# EasyEDA Pro project RinaBoard_V1_0.eprj, schematic LEDBoard
Board Name: LEDBoard; Create Date: 2024-11-24; Page Name: P1; Project Name: RinaBoard; Schematic Name: LEDBoard; Update Date: 2024-11-25; Company: 嘉立创EDA; Page Size: A4; Version: V1.0
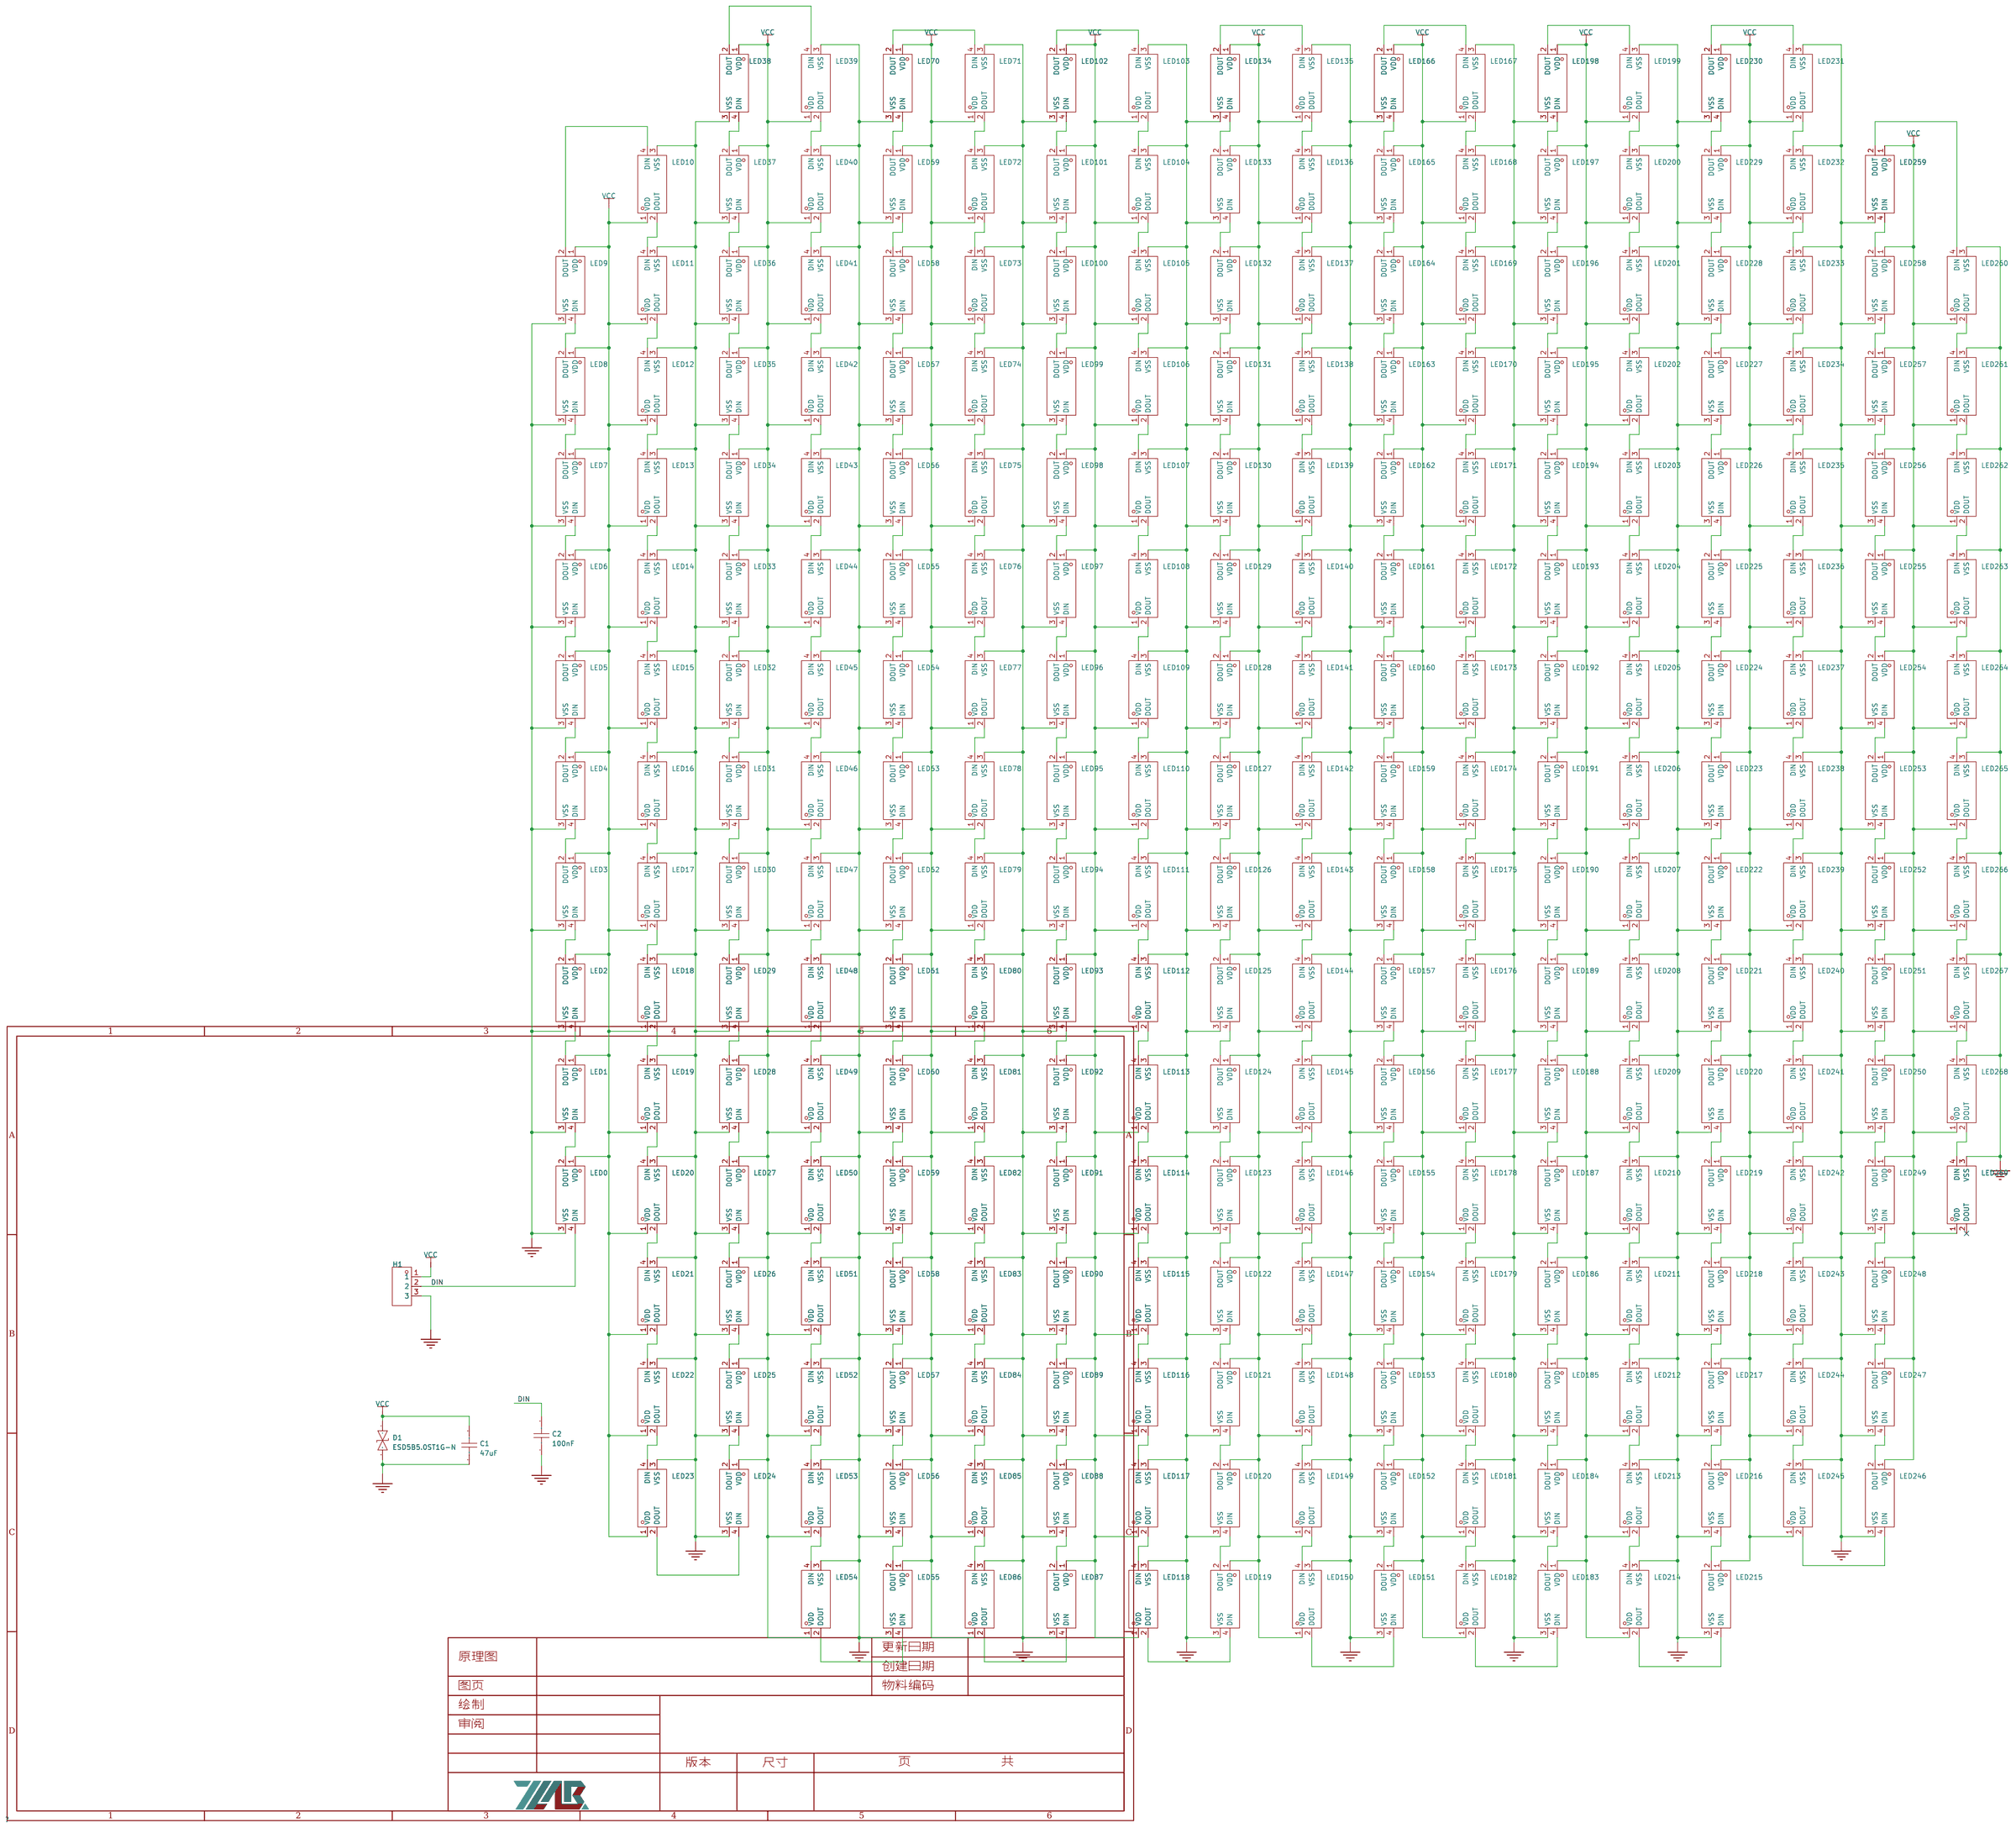
[diagram p0: schematic sheet]

## Parts
C1  47uF  [C1206]
C2  100nF  [C0603]
D1  ESD5B5.0ST1G-N  [SOD-523_L1.2-W0.8-LS1.6-BI]
H1  -  [HDR-TH_3P-P2.54-V-F]
LED0  WS2812B-MINI-V3/W  [LED-SMD_4P-L3.5-W3.5-TL_WS2812B]
LED1  WS2812B-MINI-V3/W  [LED-SMD_4P-L3.5-W3.5-TL_WS2812B]
LED2  WS2812B-MINI-V3/W  [LED-SMD_4P-L3.5-W3.5-TL_WS2812B]
LED3  WS2812B-MINI-V3/W  [LED-SMD_4P-L3.5-W3.5-TL_WS2812B]
LED4  WS2812B-MINI-V3/W  [LED-SMD_4P-L3.5-W3.5-TL_WS2812B]
LED5  WS2812B-MINI-V3/W  [LED-SMD_4P-L3.5-W3.5-TL_WS2812B]
LED6  WS2812B-MINI-V3/W  [LED-SMD_4P-L3.5-W3.5-TL_WS2812B]
LED7  WS2812B-MINI-V3/W  [LED-SMD_4P-L3.5-W3.5-TL_WS2812B]
LED8  WS2812B-MINI-V3/W  [LED-SMD_4P-L3.5-W3.5-TL_WS2812B]
LED9  WS2812B-MINI-V3/W  [LED-SMD_4P-L3.5-W3.5-TL_WS2812B]
LED10  WS2812B-MINI-V3/W  [LED-SMD_4P-L3.5-W3.5-TL_WS2812B]
LED11  WS2812B-MINI-V3/W  [LED-SMD_4P-L3.5-W3.5-TL_WS2812B]
LED12  WS2812B-MINI-V3/W  [LED-SMD_4P-L3.5-W3.5-TL_WS2812B]
LED13  WS2812B-MINI-V3/W  [LED-SMD_4P-L3.5-W3.5-TL_WS2812B]
LED14  WS2812B-MINI-V3/W  [LED-SMD_4P-L3.5-W3.5-TL_WS2812B]
LED15  WS2812B-MINI-V3/W  [LED-SMD_4P-L3.5-W3.5-TL_WS2812B]
LED16  WS2812B-MINI-V3/W  [LED-SMD_4P-L3.5-W3.5-TL_WS2812B]
LED17  WS2812B-MINI-V3/W  [LED-SMD_4P-L3.5-W3.5-TL_WS2812B]
LED18  WS2812B-MINI-V3/W  [LED-SMD_4P-L3.5-W3.5-TL_WS2812B]
LED19  WS2812B-MINI-V3/W  [LED-SMD_4P-L3.5-W3.5-TL_WS2812B]
LED20  WS2812B-MINI-V3/W  [LED-SMD_4P-L3.5-W3.5-TL_WS2812B]
LED21  WS2812B-MINI-V3/W  [LED-SMD_4P-L3.5-W3.5-TL_WS2812B]
LED22  WS2812B-MINI-V3/W  [LED-SMD_4P-L3.5-W3.5-TL_WS2812B]
LED23  WS2812B-MINI-V3/W  [LED-SMD_4P-L3.5-W3.5-TL_WS2812B]
LED24  WS2812B-MINI-V3/W  [LED-SMD_4P-L3.5-W3.5-TL_WS2812B]
LED25  WS2812B-MINI-V3/W  [LED-SMD_4P-L3.5-W3.5-TL_WS2812B]
LED26  WS2812B-MINI-V3/W  [LED-SMD_4P-L3.5-W3.5-TL_WS2812B]
LED27  WS2812B-MINI-V3/W  [LED-SMD_4P-L3.5-W3.5-TL_WS2812B]
LED28  WS2812B-MINI-V3/W  [LED-SMD_4P-L3.5-W3.5-TL_WS2812B]
LED29  WS2812B-MINI-V3/W  [LED-SMD_4P-L3.5-W3.5-TL_WS2812B]
LED30  WS2812B-MINI-V3/W  [LED-SMD_4P-L3.5-W3.5-TL_WS2812B]
LED31  WS2812B-MINI-V3/W  [LED-SMD_4P-L3.5-W3.5-TL_WS2812B]
LED32  WS2812B-MINI-V3/W  [LED-SMD_4P-L3.5-W3.5-TL_WS2812B]
LED33  WS2812B-MINI-V3/W  [LED-SMD_4P-L3.5-W3.5-TL_WS2812B]
LED34  WS2812B-MINI-V3/W  [LED-SMD_4P-L3.5-W3.5-TL_WS2812B]
LED35  WS2812B-MINI-V3/W  [LED-SMD_4P-L3.5-W3.5-TL_WS2812B]
LED36  WS2812B-MINI-V3/W  [LED-SMD_4P-L3.5-W3.5-TL_WS2812B]
LED37  WS2812B-MINI-V3/W  [LED-SMD_4P-L3.5-W3.5-TL_WS2812B]
LED38  WS2812B-MINI-V3/W  [LED-SMD_4P-L3.5-W3.5-TL_WS2812B]
LED39  WS2812B-MINI-V3/W  [LED-SMD_4P-L3.5-W3.5-TL_WS2812B]
LED40  WS2812B-MINI-V3/W  [LED-SMD_4P-L3.5-W3.5-TL_WS2812B]
LED41  WS2812B-MINI-V3/W  [LED-SMD_4P-L3.5-W3.5-TL_WS2812B]
LED42  WS2812B-MINI-V3/W  [LED-SMD_4P-L3.5-W3.5-TL_WS2812B]
LED43  WS2812B-MINI-V3/W  [LED-SMD_4P-L3.5-W3.5-TL_WS2812B]
LED44  WS2812B-MINI-V3/W  [LED-SMD_4P-L3.5-W3.5-TL_WS2812B]
LED45  WS2812B-MINI-V3/W  [LED-SMD_4P-L3.5-W3.5-TL_WS2812B]
LED46  WS2812B-MINI-V3/W  [LED-SMD_4P-L3.5-W3.5-TL_WS2812B]
LED47  WS2812B-MINI-V3/W  [LED-SMD_4P-L3.5-W3.5-TL_WS2812B]
LED48  WS2812B-MINI-V3/W  [LED-SMD_4P-L3.5-W3.5-TL_WS2812B]
LED49  WS2812B-MINI-V3/W  [LED-SMD_4P-L3.5-W3.5-TL_WS2812B]
LED50  WS2812B-MINI-V3/W  [LED-SMD_4P-L3.5-W3.5-TL_WS2812B]
LED51  WS2812B-MINI-V3/W  [LED-SMD_4P-L3.5-W3.5-TL_WS2812B]
LED52  WS2812B-MINI-V3/W  [LED-SMD_4P-L3.5-W3.5-TL_WS2812B]
LED53  WS2812B-MINI-V3/W  [LED-SMD_4P-L3.5-W3.5-TL_WS2812B]
LED54  WS2812B-MINI-V3/W  [LED-SMD_4P-L3.5-W3.5-TL_WS2812B]
LED55  WS2812B-MINI-V3/W  [LED-SMD_4P-L3.5-W3.5-TL_WS2812B]
LED56  WS2812B-MINI-V3/W  [LED-SMD_4P-L3.5-W3.5-TL_WS2812B]
LED57  WS2812B-MINI-V3/W  [LED-SMD_4P-L3.5-W3.5-TL_WS2812B]
LED58  WS2812B-MINI-V3/W  [LED-SMD_4P-L3.5-W3.5-TL_WS2812B]
LED59  WS2812B-MINI-V3/W  [LED-SMD_4P-L3.5-W3.5-TL_WS2812B]
LED60  WS2812B-MINI-V3/W  [LED-SMD_4P-L3.5-W3.5-TL_WS2812B]
LED61  WS2812B-MINI-V3/W  [LED-SMD_4P-L3.5-W3.5-TL_WS2812B]
LED62  WS2812B-MINI-V3/W  [LED-SMD_4P-L3.5-W3.5-TL_WS2812B]
LED63  WS2812B-MINI-V3/W  [LED-SMD_4P-L3.5-W3.5-TL_WS2812B]
LED64  WS2812B-MINI-V3/W  [LED-SMD_4P-L3.5-W3.5-TL_WS2812B]
LED65  WS2812B-MINI-V3/W  [LED-SMD_4P-L3.5-W3.5-TL_WS2812B]
LED66  WS2812B-MINI-V3/W  [LED-SMD_4P-L3.5-W3.5-TL_WS2812B]
LED67  WS2812B-MINI-V3/W  [LED-SMD_4P-L3.5-W3.5-TL_WS2812B]
LED68  WS2812B-MINI-V3/W  [LED-SMD_4P-L3.5-W3.5-TL_WS2812B]
LED69  WS2812B-MINI-V3/W  [LED-SMD_4P-L3.5-W3.5-TL_WS2812B]
LED70  WS2812B-MINI-V3/W  [LED-SMD_4P-L3.5-W3.5-TL_WS2812B]
LED71  WS2812B-MINI-V3/W  [LED-SMD_4P-L3.5-W3.5-TL_WS2812B]
LED72  WS2812B-MINI-V3/W  [LED-SMD_4P-L3.5-W3.5-TL_WS2812B]
LED73  WS2812B-MINI-V3/W  [LED-SMD_4P-L3.5-W3.5-TL_WS2812B]
LED74  WS2812B-MINI-V3/W  [LED-SMD_4P-L3.5-W3.5-TL_WS2812B]
LED75  WS2812B-MINI-V3/W  [LED-SMD_4P-L3.5-W3.5-TL_WS2812B]
LED76  WS2812B-MINI-V3/W  [LED-SMD_4P-L3.5-W3.5-TL_WS2812B]
LED77  WS2812B-MINI-V3/W  [LED-SMD_4P-L3.5-W3.5-TL_WS2812B]
LED78  WS2812B-MINI-V3/W  [LED-SMD_4P-L3.5-W3.5-TL_WS2812B]
LED79  WS2812B-MINI-V3/W  [LED-SMD_4P-L3.5-W3.5-TL_WS2812B]
LED80  WS2812B-MINI-V3/W  [LED-SMD_4P-L3.5-W3.5-TL_WS2812B]
LED81  WS2812B-MINI-V3/W  [LED-SMD_4P-L3.5-W3.5-TL_WS2812B]
LED82  WS2812B-MINI-V3/W  [LED-SMD_4P-L3.5-W3.5-TL_WS2812B]
LED83  WS2812B-MINI-V3/W  [LED-SMD_4P-L3.5-W3.5-TL_WS2812B]
LED84  WS2812B-MINI-V3/W  [LED-SMD_4P-L3.5-W3.5-TL_WS2812B]
LED85  WS2812B-MINI-V3/W  [LED-SMD_4P-L3.5-W3.5-TL_WS2812B]
LED86  WS2812B-MINI-V3/W  [LED-SMD_4P-L3.5-W3.5-TL_WS2812B]
LED87  WS2812B-MINI-V3/W  [LED-SMD_4P-L3.5-W3.5-TL_WS2812B]
LED88  WS2812B-MINI-V3/W  [LED-SMD_4P-L3.5-W3.5-TL_WS2812B]
LED89  WS2812B-MINI-V3/W  [LED-SMD_4P-L3.5-W3.5-TL_WS2812B]
LED90  WS2812B-MINI-V3/W  [LED-SMD_4P-L3.5-W3.5-TL_WS2812B]
LED91  WS2812B-MINI-V3/W  [LED-SMD_4P-L3.5-W3.5-TL_WS2812B]
LED92  WS2812B-MINI-V3/W  [LED-SMD_4P-L3.5-W3.5-TL_WS2812B]
LED93  WS2812B-MINI-V3/W  [LED-SMD_4P-L3.5-W3.5-TL_WS2812B]
LED94  WS2812B-MINI-V3/W  [LED-SMD_4P-L3.5-W3.5-TL_WS2812B]
LED95  WS2812B-MINI-V3/W  [LED-SMD_4P-L3.5-W3.5-TL_WS2812B]
LED96  WS2812B-MINI-V3/W  [LED-SMD_4P-L3.5-W3.5-TL_WS2812B]
LED97  WS2812B-MINI-V3/W  [LED-SMD_4P-L3.5-W3.5-TL_WS2812B]
LED98  WS2812B-MINI-V3/W  [LED-SMD_4P-L3.5-W3.5-TL_WS2812B]
LED99  WS2812B-MINI-V3/W  [LED-SMD_4P-L3.5-W3.5-TL_WS2812B]
LED100  WS2812B-MINI-V3/W  [LED-SMD_4P-L3.5-W3.5-TL_WS2812B]
LED101  WS2812B-MINI-V3/W  [LED-SMD_4P-L3.5-W3.5-TL_WS2812B]
LED102  WS2812B-MINI-V3/W  [LED-SMD_4P-L3.5-W3.5-TL_WS2812B]
LED103  WS2812B-MINI-V3/W  [LED-SMD_4P-L3.5-W3.5-TL_WS2812B]
LED104  WS2812B-MINI-V3/W  [LED-SMD_4P-L3.5-W3.5-TL_WS2812B]
LED105  WS2812B-MINI-V3/W  [LED-SMD_4P-L3.5-W3.5-TL_WS2812B]
LED106  WS2812B-MINI-V3/W  [LED-SMD_4P-L3.5-W3.5-TL_WS2812B]
LED107  WS2812B-MINI-V3/W  [LED-SMD_4P-L3.5-W3.5-TL_WS2812B]
LED108  WS2812B-MINI-V3/W  [LED-SMD_4P-L3.5-W3.5-TL_WS2812B]
LED109  WS2812B-MINI-V3/W  [LED-SMD_4P-L3.5-W3.5-TL_WS2812B]
LED110  WS2812B-MINI-V3/W  [LED-SMD_4P-L3.5-W3.5-TL_WS2812B]
LED111  WS2812B-MINI-V3/W  [LED-SMD_4P-L3.5-W3.5-TL_WS2812B]
LED112  WS2812B-MINI-V3/W  [LED-SMD_4P-L3.5-W3.5-TL_WS2812B]
LED113  WS2812B-MINI-V3/W  [LED-SMD_4P-L3.5-W3.5-TL_WS2812B]
LED114  WS2812B-MINI-V3/W  [LED-SMD_4P-L3.5-W3.5-TL_WS2812B]
LED115  WS2812B-MINI-V3/W  [LED-SMD_4P-L3.5-W3.5-TL_WS2812B]
LED116  WS2812B-MINI-V3/W  [LED-SMD_4P-L3.5-W3.5-TL_WS2812B]
LED117  WS2812B-MINI-V3/W  [LED-SMD_4P-L3.5-W3.5-TL_WS2812B]
LED118  WS2812B-MINI-V3/W  [LED-SMD_4P-L3.5-W3.5-TL_WS2812B]
LED119  WS2812B-MINI-V3/W  [LED-SMD_4P-L3.5-W3.5-TL_WS2812B]
LED120  WS2812B-MINI-V3/W  [LED-SMD_4P-L3.5-W3.5-TL_WS2812B]
LED121  WS2812B-MINI-V3/W  [LED-SMD_4P-L3.5-W3.5-TL_WS2812B]
LED122  WS2812B-MINI-V3/W  [LED-SMD_4P-L3.5-W3.5-TL_WS2812B]
LED123  WS2812B-MINI-V3/W  [LED-SMD_4P-L3.5-W3.5-TL_WS2812B]
LED124  WS2812B-MINI-V3/W  [LED-SMD_4P-L3.5-W3.5-TL_WS2812B]
LED125  WS2812B-MINI-V3/W  [LED-SMD_4P-L3.5-W3.5-TL_WS2812B]
LED126  WS2812B-MINI-V3/W  [LED-SMD_4P-L3.5-W3.5-TL_WS2812B]
LED127  WS2812B-MINI-V3/W  [LED-SMD_4P-L3.5-W3.5-TL_WS2812B]
LED128  WS2812B-MINI-V3/W  [LED-SMD_4P-L3.5-W3.5-TL_WS2812B]
LED129  WS2812B-MINI-V3/W  [LED-SMD_4P-L3.5-W3.5-TL_WS2812B]
LED130  WS2812B-MINI-V3/W  [LED-SMD_4P-L3.5-W3.5-TL_WS2812B]
LED131  WS2812B-MINI-V3/W  [LED-SMD_4P-L3.5-W3.5-TL_WS2812B]
LED132  WS2812B-MINI-V3/W  [LED-SMD_4P-L3.5-W3.5-TL_WS2812B]
LED133  WS2812B-MINI-V3/W  [LED-SMD_4P-L3.5-W3.5-TL_WS2812B]
LED134  WS2812B-MINI-V3/W  [LED-SMD_4P-L3.5-W3.5-TL_WS2812B]
LED135  WS2812B-MINI-V3/W  [LED-SMD_4P-L3.5-W3.5-TL_WS2812B]
LED136  WS2812B-MINI-V3/W  [LED-SMD_4P-L3.5-W3.5-TL_WS2812B]
LED137  WS2812B-MINI-V3/W  [LED-SMD_4P-L3.5-W3.5-TL_WS2812B]
LED138  WS2812B-MINI-V3/W  [LED-SMD_4P-L3.5-W3.5-TL_WS2812B]
LED139  WS2812B-MINI-V3/W  [LED-SMD_4P-L3.5-W3.5-TL_WS2812B]
LED140  WS2812B-MINI-V3/W  [LED-SMD_4P-L3.5-W3.5-TL_WS2812B]
LED141  WS2812B-MINI-V3/W  [LED-SMD_4P-L3.5-W3.5-TL_WS2812B]
LED142  WS2812B-MINI-V3/W  [LED-SMD_4P-L3.5-W3.5-TL_WS2812B]
LED143  WS2812B-MINI-V3/W  [LED-SMD_4P-L3.5-W3.5-TL_WS2812B]
LED144  WS2812B-MINI-V3/W  [LED-SMD_4P-L3.5-W3.5-TL_WS2812B]
LED145  WS2812B-MINI-V3/W  [LED-SMD_4P-L3.5-W3.5-TL_WS2812B]
LED146  WS2812B-MINI-V3/W  [LED-SMD_4P-L3.5-W3.5-TL_WS2812B]
LED147  WS2812B-MINI-V3/W  [LED-SMD_4P-L3.5-W3.5-TL_WS2812B]
LED148  WS2812B-MINI-V3/W  [LED-SMD_4P-L3.5-W3.5-TL_WS2812B]
LED149  WS2812B-MINI-V3/W  [LED-SMD_4P-L3.5-W3.5-TL_WS2812B]
LED150  WS2812B-MINI-V3/W  [LED-SMD_4P-L3.5-W3.5-TL_WS2812B]
LED151  WS2812B-MINI-V3/W  [LED-SMD_4P-L3.5-W3.5-TL_WS2812B]
LED152  WS2812B-MINI-V3/W  [LED-SMD_4P-L3.5-W3.5-TL_WS2812B]
LED153  WS2812B-MINI-V3/W  [LED-SMD_4P-L3.5-W3.5-TL_WS2812B]
LED154  WS2812B-MINI-V3/W  [LED-SMD_4P-L3.5-W3.5-TL_WS2812B]
LED155  WS2812B-MINI-V3/W  [LED-SMD_4P-L3.5-W3.5-TL_WS2812B]
LED156  WS2812B-MINI-V3/W  [LED-SMD_4P-L3.5-W3.5-TL_WS2812B]
LED157  WS2812B-MINI-V3/W  [LED-SMD_4P-L3.5-W3.5-TL_WS2812B]
LED158  WS2812B-MINI-V3/W  [LED-SMD_4P-L3.5-W3.5-TL_WS2812B]
LED159  WS2812B-MINI-V3/W  [LED-SMD_4P-L3.5-W3.5-TL_WS2812B]
LED160  WS2812B-MINI-V3/W  [LED-SMD_4P-L3.5-W3.5-TL_WS2812B]
LED161  WS2812B-MINI-V3/W  [LED-SMD_4P-L3.5-W3.5-TL_WS2812B]
LED162  WS2812B-MINI-V3/W  [LED-SMD_4P-L3.5-W3.5-TL_WS2812B]
LED163  WS2812B-MINI-V3/W  [LED-SMD_4P-L3.5-W3.5-TL_WS2812B]
LED164  WS2812B-MINI-V3/W  [LED-SMD_4P-L3.5-W3.5-TL_WS2812B]
LED165  WS2812B-MINI-V3/W  [LED-SMD_4P-L3.5-W3.5-TL_WS2812B]
LED166  WS2812B-MINI-V3/W  [LED-SMD_4P-L3.5-W3.5-TL_WS2812B]
LED167  WS2812B-MINI-V3/W  [LED-SMD_4P-L3.5-W3.5-TL_WS2812B]
LED168  WS2812B-MINI-V3/W  [LED-SMD_4P-L3.5-W3.5-TL_WS2812B]
LED169  WS2812B-MINI-V3/W  [LED-SMD_4P-L3.5-W3.5-TL_WS2812B]
LED170  WS2812B-MINI-V3/W  [LED-SMD_4P-L3.5-W3.5-TL_WS2812B]
LED171  WS2812B-MINI-V3/W  [LED-SMD_4P-L3.5-W3.5-TL_WS2812B]
LED172  WS2812B-MINI-V3/W  [LED-SMD_4P-L3.5-W3.5-TL_WS2812B]
LED173  WS2812B-MINI-V3/W  [LED-SMD_4P-L3.5-W3.5-TL_WS2812B]
LED174  WS2812B-MINI-V3/W  [LED-SMD_4P-L3.5-W3.5-TL_WS2812B]
LED175  WS2812B-MINI-V3/W  [LED-SMD_4P-L3.5-W3.5-TL_WS2812B]
LED176  WS2812B-MINI-V3/W  [LED-SMD_4P-L3.5-W3.5-TL_WS2812B]
LED177  WS2812B-MINI-V3/W  [LED-SMD_4P-L3.5-W3.5-TL_WS2812B]
LED178  WS2812B-MINI-V3/W  [LED-SMD_4P-L3.5-W3.5-TL_WS2812B]
LED179  WS2812B-MINI-V3/W  [LED-SMD_4P-L3.5-W3.5-TL_WS2812B]
LED180  WS2812B-MINI-V3/W  [LED-SMD_4P-L3.5-W3.5-TL_WS2812B]
LED181  WS2812B-MINI-V3/W  [LED-SMD_4P-L3.5-W3.5-TL_WS2812B]
LED182  WS2812B-MINI-V3/W  [LED-SMD_4P-L3.5-W3.5-TL_WS2812B]
LED183  WS2812B-MINI-V3/W  [LED-SMD_4P-L3.5-W3.5-TL_WS2812B]
LED184  WS2812B-MINI-V3/W  [LED-SMD_4P-L3.5-W3.5-TL_WS2812B]
LED185  WS2812B-MINI-V3/W  [LED-SMD_4P-L3.5-W3.5-TL_WS2812B]
LED186  WS2812B-MINI-V3/W  [LED-SMD_4P-L3.5-W3.5-TL_WS2812B]
LED187  WS2812B-MINI-V3/W  [LED-SMD_4P-L3.5-W3.5-TL_WS2812B]
LED188  WS2812B-MINI-V3/W  [LED-SMD_4P-L3.5-W3.5-TL_WS2812B]
LED189  WS2812B-MINI-V3/W  [LED-SMD_4P-L3.5-W3.5-TL_WS2812B]
LED190  WS2812B-MINI-V3/W  [LED-SMD_4P-L3.5-W3.5-TL_WS2812B]
LED191  WS2812B-MINI-V3/W  [LED-SMD_4P-L3.5-W3.5-TL_WS2812B]
LED192  WS2812B-MINI-V3/W  [LED-SMD_4P-L3.5-W3.5-TL_WS2812B]
LED193  WS2812B-MINI-V3/W  [LED-SMD_4P-L3.5-W3.5-TL_WS2812B]
LED194  WS2812B-MINI-V3/W  [LED-SMD_4P-L3.5-W3.5-TL_WS2812B]
LED195  WS2812B-MINI-V3/W  [LED-SMD_4P-L3.5-W3.5-TL_WS2812B]
LED196  WS2812B-MINI-V3/W  [LED-SMD_4P-L3.5-W3.5-TL_WS2812B]
LED197  WS2812B-MINI-V3/W  [LED-SMD_4P-L3.5-W3.5-TL_WS2812B]
LED198  WS2812B-MINI-V3/W  [LED-SMD_4P-L3.5-W3.5-TL_WS2812B]
LED199  WS2812B-MINI-V3/W  [LED-SMD_4P-L3.5-W3.5-TL_WS2812B]
LED200  WS2812B-MINI-V3/W  [LED-SMD_4P-L3.5-W3.5-TL_WS2812B]
LED201  WS2812B-MINI-V3/W  [LED-SMD_4P-L3.5-W3.5-TL_WS2812B]
LED202  WS2812B-MINI-V3/W  [LED-SMD_4P-L3.5-W3.5-TL_WS2812B]
LED203  WS2812B-MINI-V3/W  [LED-SMD_4P-L3.5-W3.5-TL_WS2812B]
LED204  WS2812B-MINI-V3/W  [LED-SMD_4P-L3.5-W3.5-TL_WS2812B]
LED205  WS2812B-MINI-V3/W  [LED-SMD_4P-L3.5-W3.5-TL_WS2812B]
LED206  WS2812B-MINI-V3/W  [LED-SMD_4P-L3.5-W3.5-TL_WS2812B]
LED207  WS2812B-MINI-V3/W  [LED-SMD_4P-L3.5-W3.5-TL_WS2812B]
LED208  WS2812B-MINI-V3/W  [LED-SMD_4P-L3.5-W3.5-TL_WS2812B]
LED209  WS2812B-MINI-V3/W  [LED-SMD_4P-L3.5-W3.5-TL_WS2812B]
LED210  WS2812B-MINI-V3/W  [LED-SMD_4P-L3.5-W3.5-TL_WS2812B]
LED211  WS2812B-MINI-V3/W  [LED-SMD_4P-L3.5-W3.5-TL_WS2812B]
LED212  WS2812B-MINI-V3/W  [LED-SMD_4P-L3.5-W3.5-TL_WS2812B]
LED213  WS2812B-MINI-V3/W  [LED-SMD_4P-L3.5-W3.5-TL_WS2812B]
LED214  WS2812B-MINI-V3/W  [LED-SMD_4P-L3.5-W3.5-TL_WS2812B]
LED215  WS2812B-MINI-V3/W  [LED-SMD_4P-L3.5-W3.5-TL_WS2812B]
LED216  WS2812B-MINI-V3/W  [LED-SMD_4P-L3.5-W3.5-TL_WS2812B]
LED217  WS2812B-MINI-V3/W  [LED-SMD_4P-L3.5-W3.5-TL_WS2812B]
LED218  WS2812B-MINI-V3/W  [LED-SMD_4P-L3.5-W3.5-TL_WS2812B]
LED219  WS2812B-MINI-V3/W  [LED-SMD_4P-L3.5-W3.5-TL_WS2812B]
LED220  WS2812B-MINI-V3/W  [LED-SMD_4P-L3.5-W3.5-TL_WS2812B]
LED221  WS2812B-MINI-V3/W  [LED-SMD_4P-L3.5-W3.5-TL_WS2812B]
LED222  WS2812B-MINI-V3/W  [LED-SMD_4P-L3.5-W3.5-TL_WS2812B]
LED223  WS2812B-MINI-V3/W  [LED-SMD_4P-L3.5-W3.5-TL_WS2812B]
LED224  WS2812B-MINI-V3/W  [LED-SMD_4P-L3.5-W3.5-TL_WS2812B]
LED225  WS2812B-MINI-V3/W  [LED-SMD_4P-L3.5-W3.5-TL_WS2812B]
LED226  WS2812B-MINI-V3/W  [LED-SMD_4P-L3.5-W3.5-TL_WS2812B]
LED227  WS2812B-MINI-V3/W  [LED-SMD_4P-L3.5-W3.5-TL_WS2812B]
LED228  WS2812B-MINI-V3/W  [LED-SMD_4P-L3.5-W3.5-TL_WS2812B]
LED229  WS2812B-MINI-V3/W  [LED-SMD_4P-L3.5-W3.5-TL_WS2812B]
LED230  WS2812B-MINI-V3/W  [LED-SMD_4P-L3.5-W3.5-TL_WS2812B]
LED231  WS2812B-MINI-V3/W  [LED-SMD_4P-L3.5-W3.5-TL_WS2812B]
LED232  WS2812B-MINI-V3/W  [LED-SMD_4P-L3.5-W3.5-TL_WS2812B]
LED233  WS2812B-MINI-V3/W  [LED-SMD_4P-L3.5-W3.5-TL_WS2812B]
LED234  WS2812B-MINI-V3/W  [LED-SMD_4P-L3.5-W3.5-TL_WS2812B]
LED235  WS2812B-MINI-V3/W  [LED-SMD_4P-L3.5-W3.5-TL_WS2812B]
LED236  WS2812B-MINI-V3/W  [LED-SMD_4P-L3.5-W3.5-TL_WS2812B]
LED237  WS2812B-MINI-V3/W  [LED-SMD_4P-L3.5-W3.5-TL_WS2812B]
LED238  WS2812B-MINI-V3/W  [LED-SMD_4P-L3.5-W3.5-TL_WS2812B]
LED239  WS2812B-MINI-V3/W  [LED-SMD_4P-L3.5-W3.5-TL_WS2812B]
LED240  WS2812B-MINI-V3/W  [LED-SMD_4P-L3.5-W3.5-TL_WS2812B]
LED241  WS2812B-MINI-V3/W  [LED-SMD_4P-L3.5-W3.5-TL_WS2812B]
LED242  WS2812B-MINI-V3/W  [LED-SMD_4P-L3.5-W3.5-TL_WS2812B]
LED243  WS2812B-MINI-V3/W  [LED-SMD_4P-L3.5-W3.5-TL_WS2812B]
LED244  WS2812B-MINI-V3/W  [LED-SMD_4P-L3.5-W3.5-TL_WS2812B]
LED245  WS2812B-MINI-V3/W  [LED-SMD_4P-L3.5-W3.5-TL_WS2812B]
LED246  WS2812B-MINI-V3/W  [LED-SMD_4P-L3.5-W3.5-TL_WS2812B]
LED247  WS2812B-MINI-V3/W  [LED-SMD_4P-L3.5-W3.5-TL_WS2812B]
LED248  WS2812B-MINI-V3/W  [LED-SMD_4P-L3.5-W3.5-TL_WS2812B]
LED249  WS2812B-MINI-V3/W  [LED-SMD_4P-L3.5-W3.5-TL_WS2812B]
LED250  WS2812B-MINI-V3/W  [LED-SMD_4P-L3.5-W3.5-TL_WS2812B]
LED251  WS2812B-MINI-V3/W  [LED-SMD_4P-L3.5-W3.5-TL_WS2812B]
LED252  WS2812B-MINI-V3/W  [LED-SMD_4P-L3.5-W3.5-TL_WS2812B]
LED253  WS2812B-MINI-V3/W  [LED-SMD_4P-L3.5-W3.5-TL_WS2812B]
LED254  WS2812B-MINI-V3/W  [LED-SMD_4P-L3.5-W3.5-TL_WS2812B]
LED255  WS2812B-MINI-V3/W  [LED-SMD_4P-L3.5-W3.5-TL_WS2812B]
LED256  WS2812B-MINI-V3/W  [LED-SMD_4P-L3.5-W3.5-TL_WS2812B]
LED257  WS2812B-MINI-V3/W  [LED-SMD_4P-L3.5-W3.5-TL_WS2812B]
LED258  WS2812B-MINI-V3/W  [LED-SMD_4P-L3.5-W3.5-TL_WS2812B]
LED259  WS2812B-MINI-V3/W  [LED-SMD_4P-L3.5-W3.5-TL_WS2812B]
LED260  WS2812B-MINI-V3/W  [LED-SMD_4P-L3.5-W3.5-TL_WS2812B]
LED261  WS2812B-MINI-V3/W  [LED-SMD_4P-L3.5-W3.5-TL_WS2812B]
LED262  WS2812B-MINI-V3/W  [LED-SMD_4P-L3.5-W3.5-TL_WS2812B]
LED263  WS2812B-MINI-V3/W  [LED-SMD_4P-L3.5-W3.5-TL_WS2812B]
LED264  WS2812B-MINI-V3/W  [LED-SMD_4P-L3.5-W3.5-TL_WS2812B]
LED265  WS2812B-MINI-V3/W  [LED-SMD_4P-L3.5-W3.5-TL_WS2812B]
LED266  WS2812B-MINI-V3/W  [LED-SMD_4P-L3.5-W3.5-TL_WS2812B]
LED267  WS2812B-MINI-V3/W  [LED-SMD_4P-L3.5-W3.5-TL_WS2812B]
LED268  WS2812B-MINI-V3/W  [LED-SMD_4P-L3.5-W3.5-TL_WS2812B]
LED269  WS2812B-MINI-V3/W  [LED-SMD_4P-L3.5-W3.5-TL_WS2812B]

## Library data of the parts
C1 C2 = CGA1206X5R226M350NT: LCSC Part Name: 22uF ±20% 35V; Supplier Part: C6119969; Manufacturer: HRE(芯声); Supplier Footprint: 1206; JLCPCB Part Class: 扩展库; Supplier: LCSC; Tolerance: ±20%; Voltage Rated: 35V; Temperature Coefficient: X5R
D1 = ESD5B5.0ST1G-N: Supplier Part: C316038; Manufacturer: BORN(伯恩半导体); Supplier Footprint: SOD-523; JLCPCB Part Class: 扩展库; Datasheet: https://atta.szlcsc.com/upload/public/pdf/source/20181025/C316038_E957C7145DFD1856B4D4AE56945D7135.pdf; Supplier: LCSC
H1 = HDR-F_2.54_1x3P: Supplier Part: C541850; Supplier Footprint: 插件
LED0-LED269 = WS2812B-MINI-V3/W: 小尺寸3535，无需外围元器件，有反接保护和过压保护; LCSC Part Name: RGB三色; Supplier Part: C527089; Manufacturer: worldsemi; Supplier Footprint: SMD3535; JLCPCB Part Class: 扩展库; Datasheet: https://atta.szlcsc.com/upload/public/pdf/source/20190620/C114583_ECCAEB884D1CBA01F5696FFC90F90D84.pdf; Supplier: LCSC

## Nets
GND: C1.1 C2.1 D1.2 H1.3 LED0.3(VSS) LED1.3(VSS) LED2.3(VSS) LED3.3(VSS) LED4.3(VSS) LED5.3(VSS) LED6.3(VSS) LED7.3(VSS) LED8.3(VSS) LED9.3(VSS) LED10.3(VSS) LED11.3(VSS) LED12.3(VSS) LED13.3(VSS) LED14.3(VSS) LED15.3(VSS) LED16.3(VSS) LED17.3(VSS) LED18.3(VSS) LED19.3(VSS) LED20.3(VSS) LED21.3(VSS) LED22.3(VSS) LED23.3(VSS) LED24.3(VSS) LED25.3(VSS) LED26.3(VSS) LED27.3(VSS) LED28.3(VSS) LED29.3(VSS) LED30.3(VSS) LED31.3(VSS) LED32.3(VSS) LED33.3(VSS) LED34.3(VSS) LED35.3(VSS) LED36.3(VSS) LED37.3(VSS) LED38.3(VSS) LED39.3(VSS) LED40.3(VSS) LED41.3(VSS) LED42.3(VSS) LED43.3(VSS) LED44.3(VSS) LED45.3(VSS) LED46.3(VSS) LED47.3(VSS) LED48.3(VSS) LED49.3(VSS) LED50.3(VSS) LED51.3(VSS) LED52.3(VSS) LED53.3(VSS) LED54.3(VSS) LED55.3(VSS) LED56.3(VSS) LED57.3(VSS) LED58.3(VSS) LED59.3(VSS) LED60.3(VSS) LED61.3(VSS) LED62.3(VSS) LED63.3(VSS) LED64.3(VSS) LED65.3(VSS) LED66.3(VSS) LED67.3(VSS) LED68.3(VSS) LED69.3(VSS) LED70.3(VSS) LED71.3(VSS) LED72.3(VSS) LED73.3(VSS) LED74.3(VSS) LED75.3(VSS) LED76.3(VSS) LED77.3(VSS) LED78.3(VSS) LED79.3(VSS) LED80.3(VSS) LED81.3(VSS) LED82.3(VSS) LED83.3(VSS) LED84.3(VSS) LED85.3(VSS) LED86.3(VSS) LED87.3(VSS) LED88.3(VSS) LED89.3(VSS) LED90.3(VSS) LED91.3(VSS) LED92.3(VSS) LED93.3(VSS) LED94.3(VSS) LED95.3(VSS) LED96.3(VSS) LED97.3(VSS) LED98.3(VSS) LED99.3(VSS) LED100.3(VSS) LED101.3(VSS) LED102.3(VSS) LED103.3(VSS) LED104.3(VSS) LED105.3(VSS) LED106.3(VSS) LED107.3(VSS) LED108.3(VSS) LED109.3(VSS) LED110.3(VSS) LED111.3(VSS) LED112.3(VSS) LED113.3(VSS) LED114.3(VSS) LED115.3(VSS) LED116.3(VSS) LED117.3(VSS) LED118.3(VSS) LED119.3(VSS) LED120.3(VSS) LED121.3(VSS) LED122.3(VSS) LED123.3(VSS) LED124.3(VSS) LED125.3(VSS) LED126.3(VSS) LED127.3(VSS) LED128.3(VSS) LED129.3(VSS) LED130.3(VSS) LED131.3(VSS) LED132.3(VSS) LED133.3(VSS) LED134.3(VSS) LED135.3(VSS) LED136.3(VSS) LED137.3(VSS) LED138.3(VSS) LED139.3(VSS) LED140.3(VSS) LED141.3(VSS) LED142.3(VSS) LED143.3(VSS) LED144.3(VSS) LED145.3(VSS) LED146.3(VSS) LED147.3(VSS) LED148.3(VSS) LED149.3(VSS) LED150.3(VSS) LED151.3(VSS) LED152.3(VSS) LED153.3(VSS) LED154.3(VSS) LED155.3(VSS) LED156.3(VSS) LED157.3(VSS) LED158.3(VSS) LED159.3(VSS) LED160.3(VSS) LED161.3(VSS) LED162.3(VSS) LED163.3(VSS) LED164.3(VSS) LED165.3(VSS) LED166.3(VSS) LED167.3(VSS) LED168.3(VSS) LED169.3(VSS) LED170.3(VSS) LED171.3(VSS) LED172.3(VSS) LED173.3(VSS) LED174.3(VSS) LED175.3(VSS) LED176.3(VSS) LED177.3(VSS) LED178.3(VSS) LED179.3(VSS) LED180.3(VSS) LED181.3(VSS) LED182.3(VSS) LED183.3(VSS) LED184.3(VSS) LED185.3(VSS) LED186.3(VSS) LED187.3(VSS) LED188.3(VSS) LED189.3(VSS) LED190.3(VSS) LED191.3(VSS) LED192.3(VSS) LED193.3(VSS) LED194.3(VSS) LED195.3(VSS) LED196.3(VSS) LED197.3(VSS) LED198.3(VSS) LED199.3(VSS) LED200.3(VSS) LED201.3(VSS) LED202.3(VSS) LED203.3(VSS) LED204.3(VSS) LED205.3(VSS) LED206.3(VSS) LED207.3(VSS) LED208.3(VSS) LED209.3(VSS) LED210.3(VSS) LED211.3(VSS) LED212.3(VSS) LED213.3(VSS) LED214.3(VSS) LED215.3(VSS) LED216.3(VSS) LED217.3(VSS) LED218.3(VSS) LED219.3(VSS) LED220.3(VSS) LED221.3(VSS) LED222.3(VSS) LED223.3(VSS) LED224.3(VSS) LED225.3(VSS) LED226.3(VSS) LED227.3(VSS) LED228.3(VSS) LED229.3(VSS) LED230.3(VSS) LED231.3(VSS) LED232.3(VSS) LED233.3(VSS) LED234.3(VSS) LED235.3(VSS) LED236.3(VSS) LED237.3(VSS) LED238.3(VSS) LED239.3(VSS) LED240.3(VSS) LED241.3(VSS) LED242.3(VSS) LED243.3(VSS) LED244.3(VSS) LED245.3(VSS) LED246.3(VSS) LED247.3(VSS) LED248.3(VSS) LED249.3(VSS) LED250.3(VSS) LED251.3(VSS) LED252.3(VSS) LED253.3(VSS) LED254.3(VSS) LED255.3(VSS) LED256.3(VSS) LED257.3(VSS) LED258.3(VSS) LED259.3(VSS) LED260.3(VSS) LED261.3(VSS) LED262.3(VSS) LED263.3(VSS) LED264.3(VSS) LED265.3(VSS) LED266.3(VSS) LED267.3(VSS) LED268.3(VSS) LED269.3(VSS)
VCC: C1.2 D1.1 H1.1 LED0.1(VDD) LED1.1(VDD) LED2.1(VDD) LED3.1(VDD) LED4.1(VDD) LED5.1(VDD) LED6.1(VDD) LED7.1(VDD) LED8.1(VDD) LED9.1(VDD) LED10.1(VDD) LED11.1(VDD) LED12.1(VDD) LED13.1(VDD) LED14.1(VDD) LED15.1(VDD) LED16.1(VDD) LED17.1(VDD) LED18.1(VDD) LED19.1(VDD) LED20.1(VDD) LED21.1(VDD) LED22.1(VDD) LED23.1(VDD) LED24.1(VDD) LED25.1(VDD) LED26.1(VDD) LED27.1(VDD) LED28.1(VDD) LED29.1(VDD) LED30.1(VDD) LED31.1(VDD) LED32.1(VDD) LED33.1(VDD) LED34.1(VDD) LED35.1(VDD) LED36.1(VDD) LED37.1(VDD) LED38.1(VDD) LED39.1(VDD) LED40.1(VDD) LED41.1(VDD) LED42.1(VDD) LED43.1(VDD) LED44.1(VDD) LED45.1(VDD) LED46.1(VDD) LED47.1(VDD) LED48.1(VDD) LED49.1(VDD) LED50.1(VDD) LED51.1(VDD) LED52.1(VDD) LED53.1(VDD) LED54.1(VDD) LED55.1(VDD) LED56.1(VDD) LED57.1(VDD) LED58.1(VDD) LED59.1(VDD) LED60.1(VDD) LED61.1(VDD) LED62.1(VDD) LED63.1(VDD) LED64.1(VDD) LED65.1(VDD) LED66.1(VDD) LED67.1(VDD) LED68.1(VDD) LED69.1(VDD) LED70.1(VDD) LED71.1(VDD) LED72.1(VDD) LED73.1(VDD) LED74.1(VDD) LED75.1(VDD) LED76.1(VDD) LED77.1(VDD) LED78.1(VDD) LED79.1(VDD) LED80.1(VDD) LED81.1(VDD) LED82.1(VDD) LED83.1(VDD) LED84.1(VDD) LED85.1(VDD) LED86.1(VDD) LED87.1(VDD) LED88.1(VDD) LED89.1(VDD) LED90.1(VDD) LED91.1(VDD) LED92.1(VDD) LED93.1(VDD) LED94.1(VDD) LED95.1(VDD) LED96.1(VDD) LED97.1(VDD) LED98.1(VDD) LED99.1(VDD) LED100.1(VDD) LED101.1(VDD) LED102.1(VDD) LED103.1(VDD) LED104.1(VDD) LED105.1(VDD) LED106.1(VDD) LED107.1(VDD) LED108.1(VDD) LED109.1(VDD) LED110.1(VDD) LED111.1(VDD) LED112.1(VDD) LED113.1(VDD) LED114.1(VDD) LED115.1(VDD) LED116.1(VDD) LED117.1(VDD) LED118.1(VDD) LED119.1(VDD) LED120.1(VDD) LED121.1(VDD) LED122.1(VDD) LED123.1(VDD) LED124.1(VDD) LED125.1(VDD) LED126.1(VDD) LED127.1(VDD) LED128.1(VDD) LED129.1(VDD) LED130.1(VDD) LED131.1(VDD) LED132.1(VDD) LED133.1(VDD) LED134.1(VDD) LED135.1(VDD) LED136.1(VDD) LED137.1(VDD) LED138.1(VDD) LED139.1(VDD) LED140.1(VDD) LED141.1(VDD) LED142.1(VDD) LED143.1(VDD) LED144.1(VDD) LED145.1(VDD) LED146.1(VDD) LED147.1(VDD) LED148.1(VDD) LED149.1(VDD) LED150.1(VDD) LED151.1(VDD) LED152.1(VDD) LED153.1(VDD) LED154.1(VDD) LED155.1(VDD) LED156.1(VDD) LED157.1(VDD) LED158.1(VDD) LED159.1(VDD) LED160.1(VDD) LED161.1(VDD) LED162.1(VDD) LED163.1(VDD) LED164.1(VDD) LED165.1(VDD) LED166.1(VDD) LED167.1(VDD) LED168.1(VDD) LED169.1(VDD) LED170.1(VDD) LED171.1(VDD) LED172.1(VDD) LED173.1(VDD) LED174.1(VDD) LED175.1(VDD) LED176.1(VDD) LED177.1(VDD) LED178.1(VDD) LED179.1(VDD) LED180.1(VDD) LED181.1(VDD) LED182.1(VDD) LED183.1(VDD) LED184.1(VDD) LED185.1(VDD) LED186.1(VDD) LED187.1(VDD) LED188.1(VDD) LED189.1(VDD) LED190.1(VDD) LED191.1(VDD) LED192.1(VDD) LED193.1(VDD) LED194.1(VDD) LED195.1(VDD) LED196.1(VDD) LED197.1(VDD) LED198.1(VDD) LED199.1(VDD) LED200.1(VDD) LED201.1(VDD) LED202.1(VDD) LED203.1(VDD) LED204.1(VDD) LED205.1(VDD) LED206.1(VDD) LED207.1(VDD) LED208.1(VDD) LED209.1(VDD) LED210.1(VDD) LED211.1(VDD) LED212.1(VDD) LED213.1(VDD) LED214.1(VDD) LED215.1(VDD) LED216.1(VDD) LED217.1(VDD) LED218.1(VDD) LED219.1(VDD) LED220.1(VDD) LED221.1(VDD) LED222.1(VDD) LED223.1(VDD) LED224.1(VDD) LED225.1(VDD) LED226.1(VDD) LED227.1(VDD) LED228.1(VDD) LED229.1(VDD) LED230.1(VDD) LED231.1(VDD) LED232.1(VDD) LED233.1(VDD) LED234.1(VDD) LED235.1(VDD) LED236.1(VDD) LED237.1(VDD) LED238.1(VDD) LED239.1(VDD) LED240.1(VDD) LED241.1(VDD) LED242.1(VDD) LED243.1(VDD) LED244.1(VDD) LED245.1(VDD) LED246.1(VDD) LED247.1(VDD) LED248.1(VDD) LED249.1(VDD) LED250.1(VDD) LED251.1(VDD) LED252.1(VDD) LED253.1(VDD) LED254.1(VDD) LED255.1(VDD) LED256.1(VDD) LED257.1(VDD) LED258.1(VDD) LED259.1(VDD) LED260.1(VDD) LED261.1(VDD) LED262.1(VDD) LED263.1(VDD) LED264.1(VDD) LED265.1(VDD) LED266.1(VDD) LED267.1(VDD) LED268.1(VDD) LED269.1(VDD)
DIN: C2.2 H1.2 LED0.4(DIN)
$1N32473: LED10.2(DOUT) LED11.4(DIN)
$1N32479: LED11.2(DOUT) LED12.4(DIN)
$1N32486: LED12.2(DOUT) LED13.4(DIN)
$1N32492: LED13.2(DOUT) LED14.4(DIN)
$1N32499: LED14.2(DOUT) LED15.4(DIN)
$1N32506: LED15.2(DOUT) LED16.4(DIN)
$1N32513: LED16.2(DOUT) LED17.4(DIN)
$1N32523: LED17.2(DOUT) LED18.4(DIN)
$1N32530: LED18.2(DOUT) LED19.4(DIN)
$1N32537: LED19.2(DOUT) LED20.4(DIN)
$1N32544: LED20.2(DOUT) LED21.4(DIN)
$1N32551: LED21.2(DOUT) LED22.4(DIN)
$1N32558: LED22.2(DOUT) LED23.4(DIN)
$1N32565: LED0.2(DOUT) LED1.4(DIN)
$1N32571: LED1.2(DOUT) LED2.4(DIN)
$1N32578: LED2.2(DOUT) LED3.4(DIN)
$1N32584: LED3.2(DOUT) LED4.4(DIN)
$1N32591: LED4.2(DOUT) LED5.4(DIN)
$1N32601: LED5.2(DOUT) LED6.4(DIN)
$1N32608: LED6.2(DOUT) LED7.4(DIN)
$1N32615: LED7.2(DOUT) LED8.4(DIN)
$1N32622: LED8.2(DOUT) LED9.4(DIN)
$1N32635: LED23.2(DOUT) LED24.4(DIN)
$1N32647: LED24.2(DOUT) LED25.4(DIN)
$1N32661: LED25.2(DOUT) LED26.4(DIN)
$1N32665: LED26.2(DOUT) LED27.4(DIN)
$1N32669: LED27.2(DOUT) LED28.4(DIN)
$1N32679: LED28.2(DOUT) LED29.4(DIN)
$1N32683: LED29.2(DOUT) LED30.4(DIN)
$1N32687: LED30.2(DOUT) LED31.4(DIN)
$1N32691: LED31.2(DOUT) LED32.4(DIN)
$1N32695: LED32.2(DOUT) LED33.4(DIN)
$1N32699: LED33.2(DOUT) LED34.4(DIN)
$1N32703: LED34.2(DOUT) LED35.4(DIN)
$1N32707: LED35.2(DOUT) LED36.4(DIN)
$1N32711: LED36.2(DOUT) LED37.4(DIN)
$1N32715: LED37.2(DOUT) LED38.4(DIN)
$1N32731: LED40.2(DOUT) LED41.4(DIN)
$1N32735: LED41.2(DOUT) LED42.4(DIN)
$1N32739: LED42.2(DOUT) LED43.4(DIN)
$1N32743: LED43.2(DOUT) LED44.4(DIN)
$1N32747: LED44.2(DOUT) LED45.4(DIN)
$1N32751: LED45.2(DOUT) LED46.4(DIN)
$1N32755: LED46.2(DOUT) LED47.4(DIN)
$1N32759: LED47.2(DOUT) LED48.4(DIN)
$1N32763: LED48.2(DOUT) LED49.4(DIN)
$1N32767: LED49.2(DOUT) LED50.4(DIN)
$1N32771: LED50.2(DOUT) LED51.4(DIN)
$1N32775: LED51.2(DOUT) LED52.4(DIN)
$1N32779: LED52.2(DOUT) LED53.4(DIN)
$1N32783: LED53.2(DOUT) LED54.4(DIN)
$1N32789: LED54.2(DOUT) LED55.4(DIN)
$1N32796: LED55.2(DOUT) LED56.4(DIN)
$1N32800: LED56.2(DOUT) LED57.4(DIN)
$1N32804: LED57.2(DOUT) LED58.4(DIN)
$1N32808: LED58.2(DOUT) LED59.4(DIN)
$1N32812: LED59.2(DOUT) LED60.4(DIN)
$1N32816: LED60.2(DOUT) LED61.4(DIN)
$1N32820: LED61.2(DOUT) LED62.4(DIN)
$1N32824: LED62.2(DOUT) LED63.4(DIN)
$1N32828: LED63.2(DOUT) LED64.4(DIN)
$1N32832: LED64.2(DOUT) LED65.4(DIN)
$1N32836: LED65.2(DOUT) LED66.4(DIN)
$1N32840: LED66.2(DOUT) LED67.4(DIN)
$1N32844: LED67.2(DOUT) LED68.4(DIN)
$1N32848: LED68.2(DOUT) LED69.4(DIN)
$1N32852: LED69.2(DOUT) LED70.4(DIN)
$1N32864: LED70.2(DOUT) LED71.4(DIN)
$1N32868: LED71.2(DOUT) LED72.4(DIN)
$1N32872: LED72.2(DOUT) LED73.4(DIN)
$1N32876: LED73.2(DOUT) LED74.4(DIN)
$1N32880: LED74.2(DOUT) LED75.4(DIN)
$1N32884: LED75.2(DOUT) LED76.4(DIN)
$1N32888: LED76.2(DOUT) LED77.4(DIN)
$1N32892: LED77.2(DOUT) LED78.4(DIN)
$1N32896: LED78.2(DOUT) LED79.4(DIN)
$1N32900: LED79.2(DOUT) LED80.4(DIN)
$1N32904: LED80.2(DOUT) LED81.4(DIN)
$1N32908: LED81.2(DOUT) LED82.4(DIN)
$1N32912: LED82.2(DOUT) LED83.4(DIN)
$1N32916: LED83.2(DOUT) LED84.4(DIN)
$1N32920: LED84.2(DOUT) LED85.4(DIN)
$1N32924: LED85.2(DOUT) LED86.4(DIN)
$1N32930: LED86.2(DOUT) LED87.4(DIN)
$1N32934: LED87.2(DOUT) LED88.4(DIN)
$1N32938: LED88.2(DOUT) LED89.4(DIN)
$1N32942: LED89.2(DOUT) LED90.4(DIN)
$1N32946: LED90.2(DOUT) LED91.4(DIN)
$1N32950: LED91.2(DOUT) LED92.4(DIN)
$1N32954: LED92.2(DOUT) LED93.4(DIN)
$1N32958: LED93.2(DOUT) LED94.4(DIN)
$1N32962: LED94.2(DOUT) LED95.4(DIN)
$1N32966: LED95.2(DOUT) LED96.4(DIN)
$1N32970: LED96.2(DOUT) LED97.4(DIN)
$1N32974: LED97.2(DOUT) LED98.4(DIN)
$1N32978: LED98.2(DOUT) LED99.4(DIN)
$1N32982: LED99.2(DOUT) LED100.4(DIN)
$1N32986: LED100.2(DOUT) LED101.4(DIN)
$1N32990: LED101.2(DOUT) LED102.4(DIN)
$1N37886: LED102.2(DOUT) LED103.4(DIN)
$1N37893: LED103.2(DOUT) LED104.4(DIN)
$1N37897: LED104.2(DOUT) LED105.4(DIN)
$1N37901: LED105.2(DOUT) LED106.4(DIN)
$1N37905: LED106.2(DOUT) LED107.4(DIN)
$1N37909: LED107.2(DOUT) LED108.4(DIN)
$1N37913: LED108.2(DOUT) LED109.4(DIN)
$1N37917: LED109.2(DOUT) LED110.4(DIN)
$1N37921: LED110.2(DOUT) LED111.4(DIN)
$1N37925: LED111.2(DOUT) LED112.4(DIN)
$1N37929: LED112.2(DOUT) LED113.4(DIN)
$1N37933: LED113.2(DOUT) LED114.4(DIN)
$1N37940: LED114.2(DOUT) LED115.4(DIN)
$1N37947: LED115.2(DOUT) LED116.4(DIN)
$1N37951: LED116.2(DOUT) LED117.4(DIN)
$1N37955: LED117.2(DOUT) LED118.4(DIN)
$1N37961: LED118.2(DOUT) LED119.4(DIN)
$1N37968: LED119.2(DOUT) LED120.4(DIN)
$1N37972: LED120.2(DOUT) LED121.4(DIN)
$1N37976: LED121.2(DOUT) LED122.4(DIN)
$1N37980: LED122.2(DOUT) LED123.4(DIN)
$1N37984: LED123.2(DOUT) LED124.4(DIN)
$1N37988: LED124.2(DOUT) LED125.4(DIN)
$1N37992: LED125.2(DOUT) LED126.4(DIN)
$1N37996: LED126.2(DOUT) LED127.4(DIN)
$1N38000: LED127.2(DOUT) LED128.4(DIN)
$1N38004: LED128.2(DOUT) LED129.4(DIN)
$1N38008: LED129.2(DOUT) LED130.4(DIN)
$1N38012: LED130.2(DOUT) LED131.4(DIN)
$1N38016: LED131.2(DOUT) LED132.4(DIN)
$1N38020: LED132.2(DOUT) LED133.4(DIN)
$1N38024: LED133.2(DOUT) LED134.4(DIN)
$1N38030: LED134.2(DOUT) LED135.4(DIN)
$1N38039: LED135.2(DOUT) LED136.4(DIN)
$1N38046: LED136.2(DOUT) LED137.4(DIN)
$1N38050: LED137.2(DOUT) LED138.4(DIN)
$1N38054: LED138.2(DOUT) LED139.4(DIN)
$1N38058: LED139.2(DOUT) LED140.4(DIN)
$1N38062: LED140.2(DOUT) LED141.4(DIN)
$1N38066: LED141.2(DOUT) LED142.4(DIN)
$1N38070: LED142.2(DOUT) LED143.4(DIN)
$1N38074: LED143.2(DOUT) LED144.4(DIN)
$1N38078: LED144.2(DOUT) LED145.4(DIN)
$1N38082: LED145.2(DOUT) LED146.4(DIN)
$1N38086: LED146.2(DOUT) LED147.4(DIN)
$1N38090: LED147.2(DOUT) LED148.4(DIN)
$1N38094: LED148.2(DOUT) LED149.4(DIN)
$1N38098: LED149.2(DOUT) LED150.4(DIN)
$1N38104: LED150.2(DOUT) LED151.4(DIN)
$1N38108: LED151.2(DOUT) LED152.4(DIN)
$1N38112: LED152.2(DOUT) LED153.4(DIN)
$1N38116: LED153.2(DOUT) LED154.4(DIN)
$1N38120: LED154.2(DOUT) LED155.4(DIN)
$1N38124: LED155.2(DOUT) LED156.4(DIN)
$1N38128: LED156.2(DOUT) LED157.4(DIN)
$1N38132: LED157.2(DOUT) LED158.4(DIN)
$1N38136: LED158.2(DOUT) LED159.4(DIN)
$1N38140: LED159.2(DOUT) LED160.4(DIN)
$1N38144: LED160.2(DOUT) LED161.4(DIN)
$1N38148: LED161.2(DOUT) LED162.4(DIN)
$1N38152: LED162.2(DOUT) LED163.4(DIN)
$1N38156: LED163.2(DOUT) LED164.4(DIN)
$1N38160: LED164.2(DOUT) LED165.4(DIN)
$1N38164: LED165.2(DOUT) LED166.4(DIN)
$1N38170: LED166.2(DOUT) LED167.4(DIN)
$1N38174: LED167.2(DOUT) LED168.4(DIN)
$1N38178: LED168.2(DOUT) LED169.4(DIN)
$1N38182: LED169.2(DOUT) LED170.4(DIN)
$1N38186: LED170.2(DOUT) LED171.4(DIN)
$1N38190: LED171.2(DOUT) LED172.4(DIN)
$1N38194: LED172.2(DOUT) LED173.4(DIN)
$1N38198: LED173.2(DOUT) LED174.4(DIN)
$1N38202: LED174.2(DOUT) LED175.4(DIN)
$1N38206: LED175.2(DOUT) LED176.4(DIN)
$1N38210: LED176.2(DOUT) LED177.4(DIN)
$1N38214: LED177.2(DOUT) LED178.4(DIN)
$1N38224: LED178.2(DOUT) LED179.4(DIN)
$1N38228: LED179.2(DOUT) LED180.4(DIN)
$1N38232: LED180.2(DOUT) LED181.4(DIN)
$1N38236: LED181.2(DOUT) LED182.4(DIN)
$1N38242: LED182.2(DOUT) LED183.4(DIN)
$1N38246: LED183.2(DOUT) LED184.4(DIN)
$1N38250: LED184.2(DOUT) LED185.4(DIN)
$1N38254: LED185.2(DOUT) LED186.4(DIN)
$1N38258: LED186.2(DOUT) LED187.4(DIN)
$1N38262: LED187.2(DOUT) LED188.4(DIN)
$1N38266: LED188.2(DOUT) LED189.4(DIN)
$1N38270: LED189.2(DOUT) LED190.4(DIN)
$1N38274: LED190.2(DOUT) LED191.4(DIN)
$1N38278: LED191.2(DOUT) LED192.4(DIN)
$1N38282: LED192.2(DOUT) LED193.4(DIN)
$1N38286: LED193.2(DOUT) LED194.4(DIN)
$1N38290: LED194.2(DOUT) LED195.4(DIN)
$1N38294: LED195.2(DOUT) LED196.4(DIN)
$1N38298: LED196.2(DOUT) LED197.4(DIN)
$1N38302: LED197.2(DOUT) LED198.4(DIN)
$1N38311: LED198.2(DOUT) LED199.4(DIN)
$1N38315: LED199.2(DOUT) LED200.4(DIN)
$1N38322: LED200.2(DOUT) LED201.4(DIN)
$1N38329: LED201.2(DOUT) LED202.4(DIN)
$1N38333: LED202.2(DOUT) LED203.4(DIN)
$1N38337: LED203.2(DOUT) LED204.4(DIN)
$1N38341: LED204.2(DOUT) LED205.4(DIN)
$1N38345: LED205.2(DOUT) LED206.4(DIN)
$1N38349: LED206.2(DOUT) LED207.4(DIN)
$1N38353: LED207.2(DOUT) LED208.4(DIN)
$1N38357: LED208.2(DOUT) LED209.4(DIN)
$1N38361: LED209.2(DOUT) LED210.4(DIN)
$1N38365: LED210.2(DOUT) LED211.4(DIN)
$1N38369: LED211.2(DOUT) LED212.4(DIN)
$1N38373: LED212.2(DOUT) LED213.4(DIN)
$1N38377: LED213.2(DOUT) LED214.4(DIN)
$1N38383: LED214.2(DOUT) LED215.4(DIN)
$1N38387: LED215.2(DOUT) LED216.4(DIN)
$1N38391: LED216.2(DOUT) LED217.4(DIN)
$1N38395: LED217.2(DOUT) LED218.4(DIN)
$1N38405: LED218.2(DOUT) LED219.4(DIN)
$1N38409: LED219.2(DOUT) LED220.4(DIN)
$1N38413: LED220.2(DOUT) LED221.4(DIN)
$1N38417: LED221.2(DOUT) LED222.4(DIN)
$1N38421: LED222.2(DOUT) LED223.4(DIN)
$1N38425: LED223.2(DOUT) LED224.4(DIN)
$1N38429: LED224.2(DOUT) LED225.4(DIN)
$1N38433: LED225.2(DOUT) LED226.4(DIN)
$1N38437: LED226.2(DOUT) LED227.4(DIN)
$1N38441: LED227.2(DOUT) LED228.4(DIN)
$1N38445: LED228.2(DOUT) LED229.4(DIN)
$1N38449: LED229.2(DOUT) LED230.4(DIN)
$1N38458: LED230.2(DOUT) LED231.4(DIN)
$1N38462: LED231.2(DOUT) LED232.4(DIN)
$1N38466: LED232.2(DOUT) LED233.4(DIN)
$1N38470: LED233.2(DOUT) LED234.4(DIN)
$1N38474: LED234.2(DOUT) LED235.4(DIN)
$1N38478: LED235.2(DOUT) LED236.4(DIN)
$1N38482: LED236.2(DOUT) LED237.4(DIN)
$1N38486: LED237.2(DOUT) LED238.4(DIN)
$1N38490: LED238.2(DOUT) LED239.4(DIN)
$1N38494: LED239.2(DOUT) LED240.4(DIN)
$1N38498: LED240.2(DOUT) LED241.4(DIN)
$1N38502: LED241.2(DOUT) LED242.4(DIN)
$1N38506: LED242.2(DOUT) LED243.4(DIN)
$1N38510: LED243.2(DOUT) LED244.4(DIN)
$1N38514: LED244.2(DOUT) LED245.4(DIN)
$1N38520: LED245.2(DOUT) LED246.4(DIN)
$1N38524: LED246.2(DOUT) LED247.4(DIN)
$1N38528: LED247.2(DOUT) LED248.4(DIN)
$1N38538: LED248.2(DOUT) LED249.4(DIN)
$1N38542: LED249.2(DOUT) LED250.4(DIN)
$1N38546: LED250.2(DOUT) LED251.4(DIN)
$1N38550: LED251.2(DOUT) LED252.4(DIN)
$1N38554: LED252.2(DOUT) LED253.4(DIN)
$1N38558: LED253.2(DOUT) LED254.4(DIN)
$1N38562: LED254.2(DOUT) LED255.4(DIN)
$1N38566: LED255.2(DOUT) LED256.4(DIN)
$1N38570: LED256.2(DOUT) LED257.4(DIN)
$1N38574: LED257.2(DOUT) LED258.4(DIN)
$1N38578: LED258.2(DOUT) LED259.4(DIN)
$1N38588: LED260.2(DOUT) LED261.4(DIN)
$1N38592: LED261.2(DOUT) LED262.4(DIN)
$1N38596: LED262.2(DOUT) LED263.4(DIN)
$1N38600: LED263.2(DOUT) LED264.4(DIN)
$1N38604: LED264.2(DOUT) LED265.4(DIN)
$1N38608: LED265.2(DOUT) LED266.4(DIN)
$1N38612: LED266.2(DOUT) LED267.4(DIN)
$1N38616: LED267.2(DOUT) LED268.4(DIN)
$1N38620: LED268.2(DOUT) LED269.4(DIN)
$1N40556: LED39.2(DOUT) LED40.4(DIN)
$1N49280: LED259.2(DOUT) LED260.4(DIN)
$1N49561: LED38.2(DOUT) LED39.4(DIN)
$1N49772: LED9.2(DOUT) LED10.4(DIN)

Not connected (* = marked no-connect by the designer): LED269 2(DOUT)*
